# EasyEDA Pro project ProProject_Quantum Mega_v0.2_2024-08-26.epro, schematic Templates
Create Date: 2024-05-16; Page Name: P1; Project Name: dev-car; Schematic Name: Templates; Update Date: 2024-05-17; Company: EasyEDA.com; Drawn: EasyEDA; Page Size: A4; Part Number: JLCPCB-002; Reviewed: EasyEDA; Version: V0.1
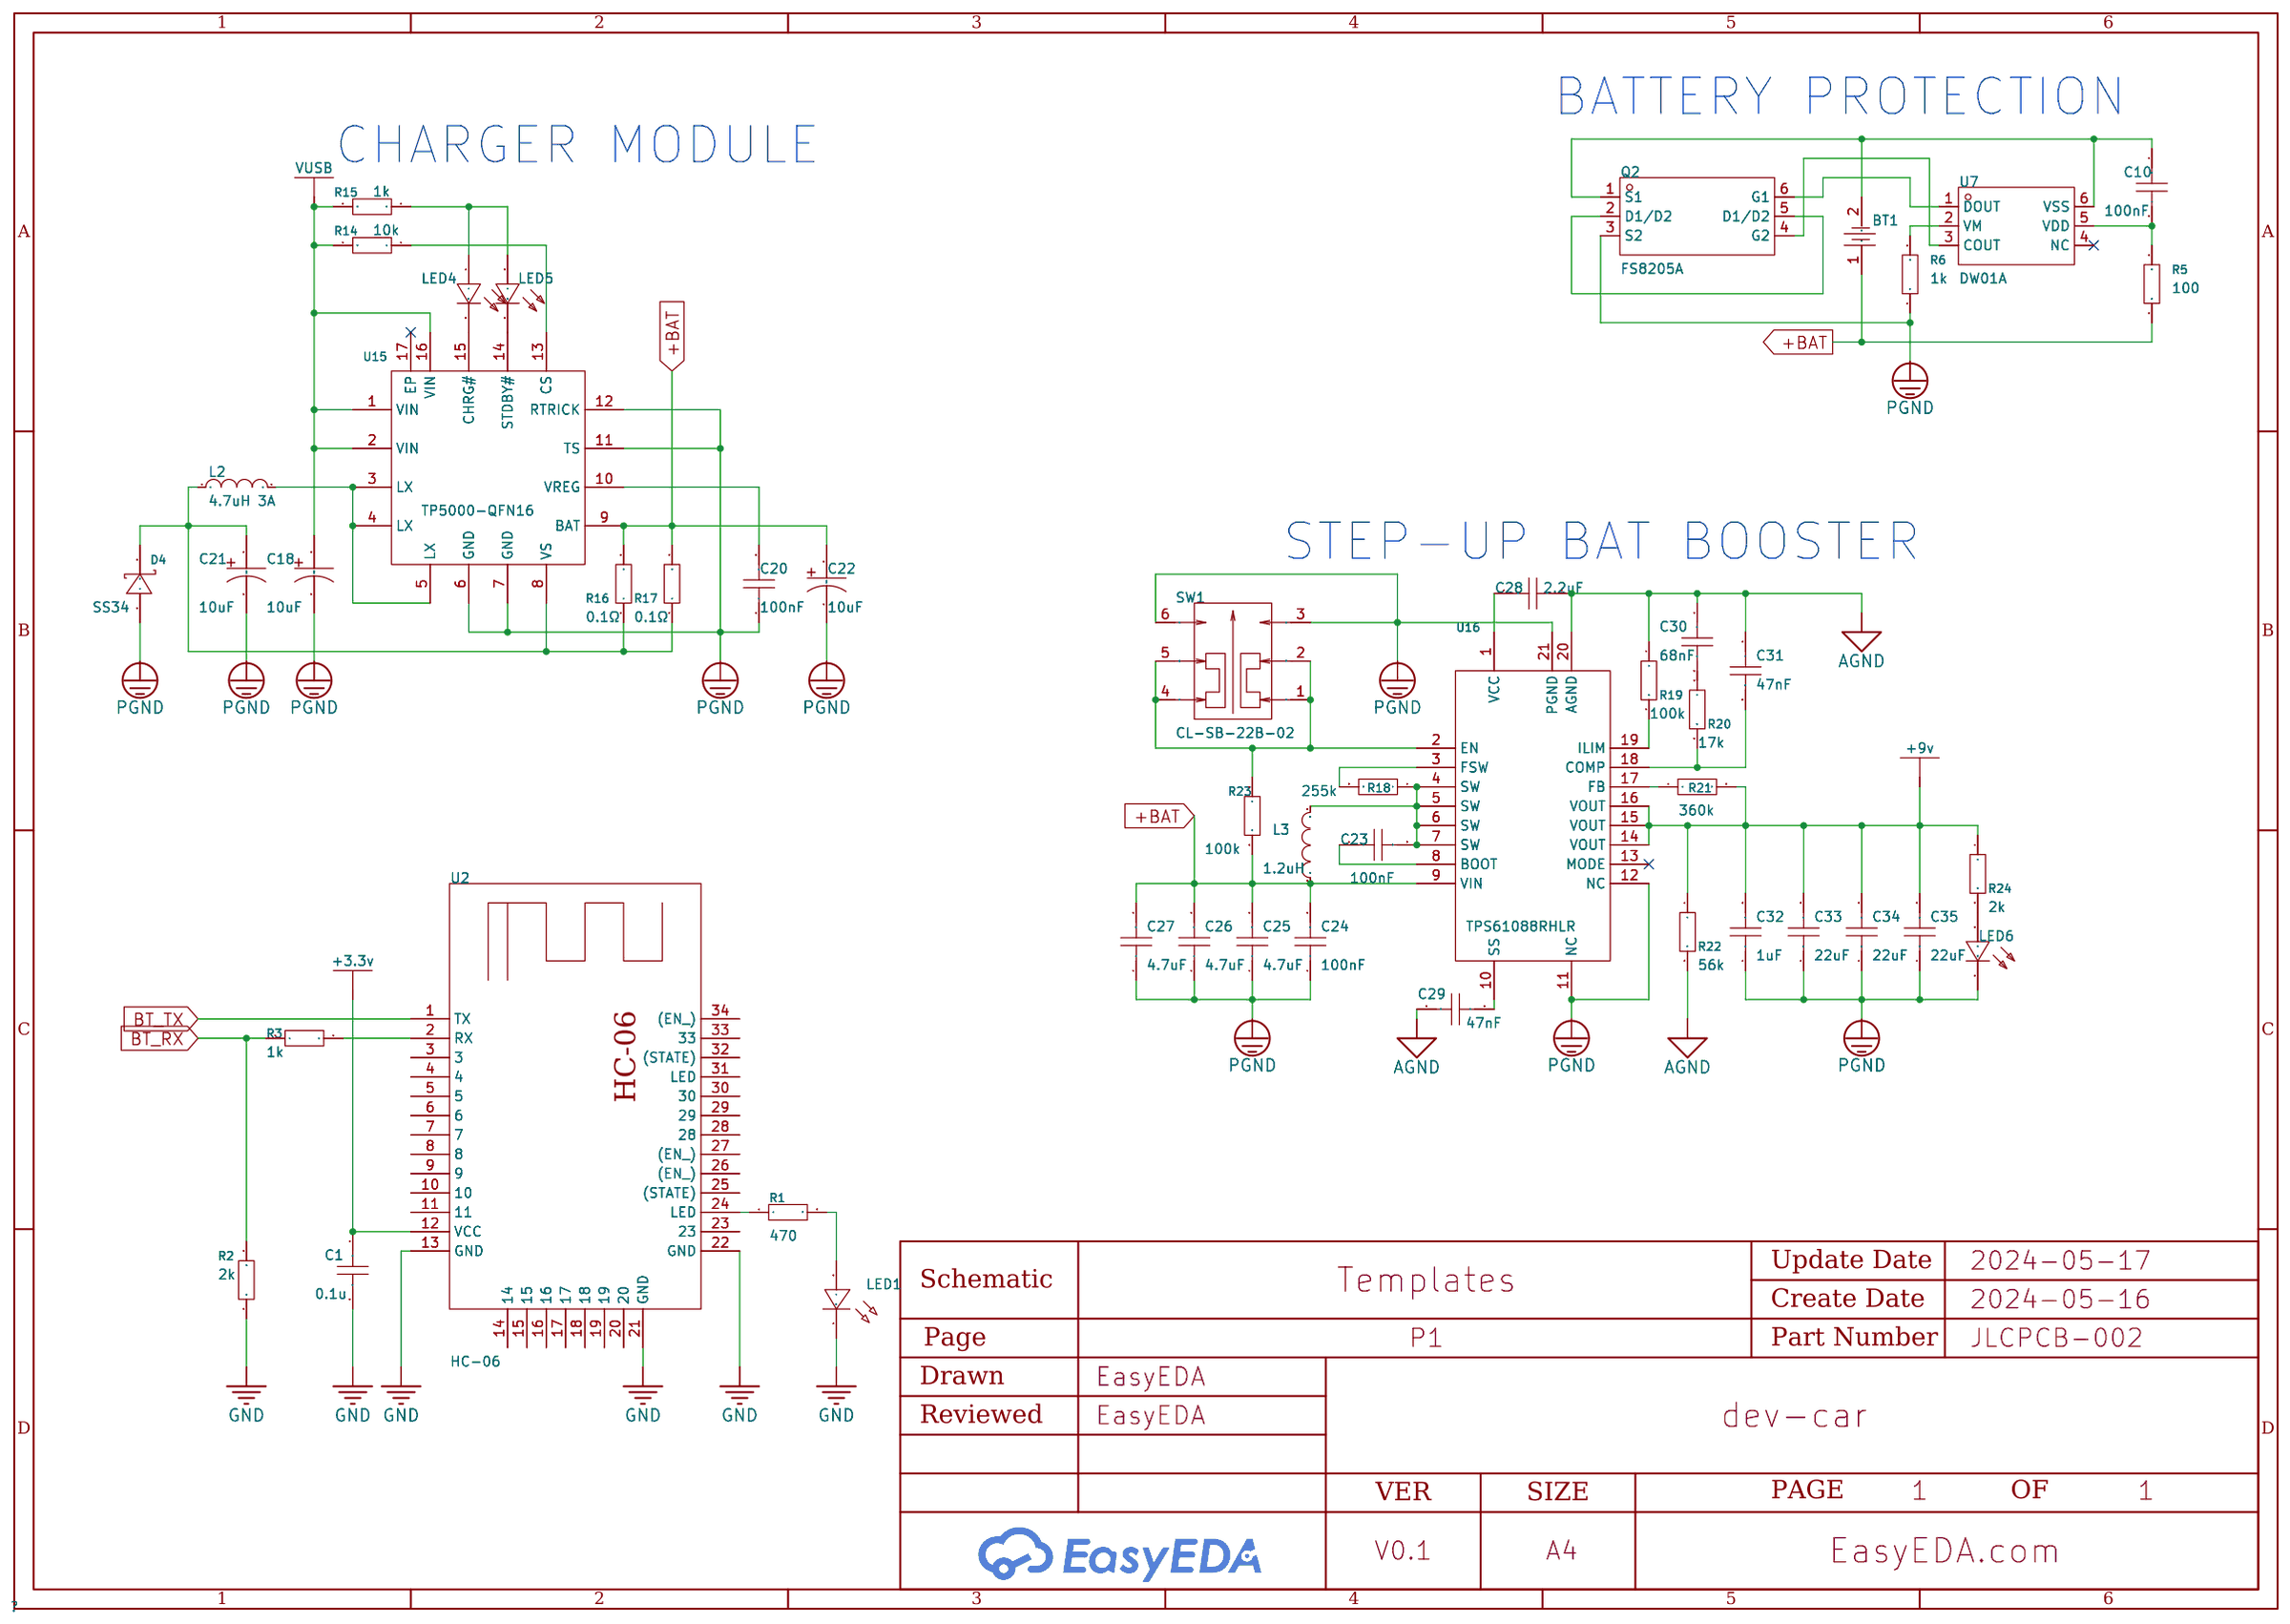
[diagram p2: schematic sheet]

## Parts
BT1  BH-18650-A5BJ001  [BAT-TH_18650-A5BJ001]
C1  0.1u  [C0805]
C10  100nF  [C0805]
C18  10uF  [CAP-SMD_BD4.0-L4.3-W4.3-LS5.3-FD]
C20  100nF  [C0805]
C21  10uF  [CAP-SMD_BD4.0-L4.3-W4.3-LS5.3-FD]
C22  10uF  [CAP-SMD_BD4.0-L4.3-W4.3-LS5.3-FD]
C23  100nF  [C0805]
C24  100nF  [C0805]
C25  4.7uF  [C1812]
C26  4.7uF  [C1812]
C27  4.7uF  [C1812]
C28  2.2uF  [C0805]
C29  47nF  [C0805]
C30  68nF  [C0805]
C31  47nF  [C0805]
C32  1uF  [C1812]
C33  22uF  [C1812]
C34  22uF  [C1812]
C35  22uF  [C1812]
D4  SS34  [SMA_L4.3-W2.6-LS5.2-RD]
L2  4.7uH 3A  [IND-SMD_L7.3-W7.3_GSDRH74P]
L3  1.2uH  [IND-SMD_L7.8-W7.8]
LED1  BT  [LED0805-RD_GREEN]
LED4  LED_0805  [LED0805-R-RD_GREEN]
LED5  LED_0805  [LED0805-R-RD_GREEN]
LED6  LED_0805  [LED0805-R-RD_GREEN]
Q2  FS8205A  [SOT-23-6_L2.9-W1.6-P0.95-LS2.8-BR]
R1  470  [R0805]
R2  2k  [R0805]
R3  1k  [R0805]
R5  100  [R0805]
R6  1k  [R0805]
R14  10k  [R0805]
R15  1k  [R0805]
R16  0.1Ω  [R1206]
R17  0.1Ω  [R1206]
R18  255k  [R0603_NEW]
R19  100k  [R0603_NEW]
R20  17k  [R0603_NEW]
R21  360k  [R0603_NEW]
R22  56k  [R0603_NEW]
R23  100k  [R0603_NEW]
R24  2k  [R0603_NEW]
SW1  CL-SB-22B-02  [SW-SMD_NIDEC_CL-SB-22B-XX]
U2  HC-06  [HC-06]
U7  DW01A  [SOT-23-6_L2.9-W1.6-P0.95-LS2.8-BR]
U15  TP5000-QFN16  [QFN-16_L4.0-W4.0-P0.65-BL-EP2.2]
U16  TPS61088RHLR  [VQFN-20_L4.6-W3.6-P0.50-BL]

## Library data of the parts
BT1 = BH-18650-A5BJ001: Supplier Part: C5383220; Manufacturer: MYOUNG(美阳); Supplier Footprint: 插件; JLCPCB Part Class: Extended Part; Datasheet: https://atta.szlcsc.com/upload/public/pdf/source/20230321/F45C04DF2D4E00D187312CBE97BD9F67.pdf; Supplier: LCSC
C1 C10 C20 C23 C24 C28-C31 = CAP_0805: Supplier Footprint: 0805
C18 C21 C22 = CAP-SMD 4*5 10uF ±10% 16V: Supplier Part: C9900020910; Supplier: LCSC
C25-C27 C32-C35 = C4532X7S2A475K230KB: Capacitance: Tolerance:±10% Tolerance:±10% Voltage Rated: Temperature Coefficient:; LCSC Part Name: 4.7uF ±10% 100V; Supplier Part: C5343513; Manufacturer: TDK; Supplier Footprint: 1812; Datasheet: https://atta.szlcsc.com/upload/public/pdf/source/20221215/52D81A5CA808B00E15B0062CF01F9008.pdf; Supplier: LCSC; Tolerance: ±10%
D4 = SS34_C8678: Diode Configuration:Single Forward Voltage (Vf@If):550mV@3A Reverse Voltage (Vr):40V Average Rectified Current (Io):3A Reverse Leakage Current (Ir):500uA@40V; LCSC Part Name: 电压:40V 电流:3A; Supplier Part: C8678; Manufacturer: MDD; Supplier Footprint: SMA(DO-214AC); JLCPCB Part Class: Basic Part; Datasheet: https://atta.szlcsc.com/upload/public/pdf/source/20230314/A80AE34493C69B89E2F4B1712F433538.pdf; Supplier: LCSC; Diode Configuration: Single; Forward Voltage (Vf@If): 550mV@3A; Reverse Voltage (Vr): 40V; Average Rectified Current (Io): 3A; Reverse Leakage Current (Ir): 500uA@40V
L2 = 4.7uH 3A: Supplier Part: C9900003590; Supplier Footprint: 4.7uH2A; Supplier: LCSC
L3 = 0830CDMCCDS-1R2MC: Inductance: Tolerance:±20% Tolerance:±20% Rated Current: Saturation Current (Isat):15.3A DC Resistance (DCR):5.6mΩ Type:- Ratings:-; LCSC Part Name: 1.2uH ±20% 15.3A; Supplier Part: C2454266; Manufacturer: Sumida(胜美达); JLCPCB Part Class: Extended Part; Datasheet: https://atta.szlcsc.com/upload/public/pdf/source/20210415/91EC99299EA15DC44F83F45F05C2BDFF.pdf; Supplier: LCSC; Tolerance: ±20%; Saturation Current (Isat): 15.3A; DC Resistance (DCR): 5.6mΩ
LED1 = LED_0805-B: Supplier Footprint: 0805
LED4-LED6 = LED_0805: Supplier Part: C9900014946; Supplier Footprint: LED0; Supplier: LCSC
Q2 = FS8205A_C2830320: Type:2 N-Channel Drain Source Voltage (Vdss): Continuous Drain Current (Id): Power Dissipation (Pd): Drain Source On Resistance (RDS(on)@Vgs,Id):19.5mΩ@4.5V,3A Gate Threshold Voltage (Vgs(th)@Id):700mV@250uA Total Gate Charge (Qg@Vgs):5.7nC@10V Input Capa; LCSC Part Name: 2个N沟道 耐压:20V 电流:6A; Supplier Part: C2830320; Manufacturer: TECH PUBLIC(台舟); Supplier Footprint: SOT-23-6; JLCPCB Part Class: Extended Part; Datasheet: https://atta.szlcsc.com/upload/public/pdf/source/20210810/F53B6D4E8755A1F8E11BAF814CE98E6A.pdf; Supplier: LCSC; Type: 2 N-Channel; Drain Source On Resistance (RDS(on)@Vgs,Id): 19.5mΩ@4.5V,3A; Gate Threshold Voltage (Vgs(th)@Id): 700mV@250uA; Total Gate Charge (Qg@Vgs): 5.7nC@10V; Input Capacitance (Ciss@Vds): 466pF@10V; Reverse Transfer Capacitance (Crss@Vds): 58pF@10V; Operating Temperature: -55℃~+150℃@(Tj)
R1-R3 R5 R6 R14 R15 R18-R24 = 0805 resistor: LCSC Part Name: 12kΩ ±1% 125mW 厚膜电阻; Supplier Part: C17444; Manufacturer: UNI-ROYAL(厚声); Manufacturer Part: 0805W8F1202T5E; Supplier Footprint: 0805; JLCPCB Part Class: Basic Part; Datasheet: https://atta.szlcsc.com/upload/public/pdf/source/20200306/C422600_1E6D84923E4A46A82E41ADD87F860B5C.pdf; Supplier: LCSC; Tolerance: ±1%; Temperature Coefficient: ±100ppm/℃; Type: Thick Film Resistors; Operating Temperature Range: -55℃~+155℃
R16 R17 = 1206W4F0000T5E: Type:Thick Film Resistors Resistance: Tolerance:±1% Tolerance:±1% Power(Watts): Overload Voltage (Max): Temperature Coefficient:±800ppm/℃ Temperature Coefficient:±800ppm/℃ Operating Temperature Range:-55℃~+155℃ Operating Temperature Range:-55℃~+155℃; LCSC Part Name: 0Ω ±1% 250mW 厚膜电阻; Supplier Part: C17888; Manufacturer: UNI-ROYAL(厚声); Supplier Footprint: 1206; JLCPCB Part Class: Basic Part; Datasheet: https://atta.szlcsc.com/upload/public/pdf/source/20200306/C422600_1E6D84923E4A46A82E41ADD87F860B5C.pdf; Supplier: LCSC; Type: Thick Film Resistors; Tolerance: ±1%; Temperature Coefficient: ±800ppm/℃; Operating Temperature Range: -55℃~+155℃
SW1 = CL-SB-22B-02: Circuit:DPDT Actuator Style:Rectangular columnar Pin Style:Gull Wing Mounting Style:Brick nogging Voltage Rating (DC):12V Operating Temperature:-40℃~+85℃ Operating Temperature:-40℃~+85℃; Supplier Part: C5573311; Manufacturer: NIDEC(尼得科); Datasheet: https://atta.szlcsc.com/upload/public/pdf/source/231023/cl-sb.pdf-55b3417ad2bcaca9f3ae11e732aa5559.pdf; Supplier: LCSC; Circuit: DPDT; Actuator Style: Rectangular columnar; Pin Style: Gull Wing; Mounting Style: Brick nogging; Voltage Rating (DC): 12V; Operating Temperature: -40℃~+85℃
U2 = HC-06: 3DModel: HC-06_3D; _: 3; NUMBER: 34
U7 = DW01A: LCSC Part Name: 锂电池保护; Supplier Part: C841289; Supplier Footprint: SOT-23-6; JLCPCB Part Class: Extended Part; Supplier: LCSC
U15 = TP5000-QFN16: Supplier Part: C51699; Manufacturer: TOPPOWER(南京拓微); Supplier Footprint: QFN-16-EP(4x4); JLCPCB Part Class: Extended Part; Datasheet: https://atta.szlcsc.com/upload/public/pdf/source/20150618/1457707323704.pdf; Supplier: LCSC
U16 = TPS61088RHLR: Function:boost converterType Output Type:Adjustable Input Voltage:2.7V~12V Input Voltage:2.7V~12V Output Voltage:4.5V~12.6V Output Voltage:4.5V~12.6V Output Current (Max):10A Switching Frequency:2.2MHz Operating Temperature:-40℃~+85℃@(TA) Operating Temper; Supplier Part: C87357; Manufacturer: TI(德州仪器); Supplier Footprint: VQFN-20(3.6x4.6); JLCPCB Part Class: Extended Part; Datasheet: https://www.ti.com/cn/lit/gpn/tps61088; Supplier: LCSC; Function: boost converterType; Output Type: Adjustable; Input Voltage: 2.7V~12V; Output Voltage: 4.5V~12.6V; Output Current (Max): 10A; Switching Frequency: 2.2MHz; Operating Temperature: -40℃~+85℃@(TA); Synchronous Rectification: Yes; Number of Outputs: 1; Topology: Boost; Switch tube (built-in/external): 内置

## Nets
+3.3v: C1.1 U2.12(VCC)
+9v: C32.2 C33.2 C34.2 C35.2 R21.2 R22.1 R24.1 U16.14(VOUT) U16.15(VOUT) U16.16(VOUT)
AGND: C28.2 C29.2 C30.1 C31.1 R19.1 R22.2 U16.20(AGND)
GND: C1.2 LED1.1(C) R2.1 U2.13(GND) U2.21(GND) U2.22(GND)
PGND: C18.2 C20.1 C21.2 C22.2 C24.1 C25.1 C26.1 C27.1 C32.1 C33.1 C34.1 C35.1 D4.2(A) LED6.2(C) Q2.3(S2) R6.1 SW1.3 SW1.6 U15.6(GND) U15.7(GND) U15.11(TS) U15.12(RTRICK) U16.11(NC) U16.12(NC) U16.21(PGND)
+BAT: BT1.1 C22.1 C24.2 C25.2 C26.2 C27.2 L3.1 R5.1 R16.2 R17.2 R23.2 U15.9(BAT) U16.9(VIN)
BT_RX: R2.2 R3.1
BT_TX: U2.1(TX)
VUSB: C18.1 R14.2 R15.2 U15.1(VIN) U15.2(VIN) U15.16(VIN)
Net-(BT1-2): BT1.2 C10.1 Q2.1(S1) U7.6(VSS)
Net-(C10-2): C10.2 R5.2 U7.5(VDD)
Net-(C20-2): C20.2 U15.10(VREG)
Net-(C21-1): C21.1 D4.1(K) L2.1 R16.1 R17.1 U15.8(VS)
Net-(C23-1): C23.1 U16.8(BOOT)
Net-(C23-2): C23.2 L3.2 R18.1 U16.4(SW) U16.5(SW) U16.6(SW) U16.7(SW)
Net-(C28-1): C28.1 U16.1(VCC)
Net-(C29-1): C29.1 U16.10(SS)
Net-(C30-2): C30.2 R20.1
Net-(C31-2): C31.2 R20.2 U16.18(COMP)
Net-(L2-2): L2.2 U15.3(LX) U15.4(LX) U15.5(LX)
Net-(LED1-2): LED1.2(A) R1.2
Net-(LED4-1): LED4.1(A) LED5.1(A) R15.1
Net-(LED4-2): LED4.2(C) U15.15(CHRG#)
Net-(LED5-2): LED5.2(C) U15.14(STDBY#)
Net-(LED6-1): LED6.1(A) R24.2
Net-(Q2-2): Q2.2(D1/D2) Q2.5(D1/D2)
Net-(Q2-4): Q2.4(G2) U7.3(COUT)
Net-(Q2-6): Q2.6(G1) U7.1(DOUT)
Net-(R1-1): R1.1 U2.24(LED)
Net-(R3-2): R3.2 U2.2(RX)
Net-(R6-2): R6.2 U7.2(VM)
Net-(R14-1): R14.1 U15.13(CS)
Net-(R18-2): R18.2 U16.3(FSW)
Net-(R19-2): R19.2 U16.19(ILIM)
Net-(R21-1): R21.1 U16.17(FB)
Net-(R23-1): R23.1 SW1.1 SW1.2 SW1.4 SW1.5 U16.2(EN)

Not connected (* = marked no-connect by the designer): U2 3 4 5 6 7 8 9 10 11 14 15 16 17 18 19 20 23 25((STATE)) 26((EN_)) 27((EN_)) 28 29 30 31(LED) 32((STATE)) 33 34((EN_)); U7 4(NC)*; U15 17(EP)*; U16 13(MODE)*

## Notes on the sheet
- BATTERY PROTECTION
- CHARGER MODULE
- STEP-UP BAT BOOSTER
